# EAGLE design 2s-lvco (EAGLE 6.4)
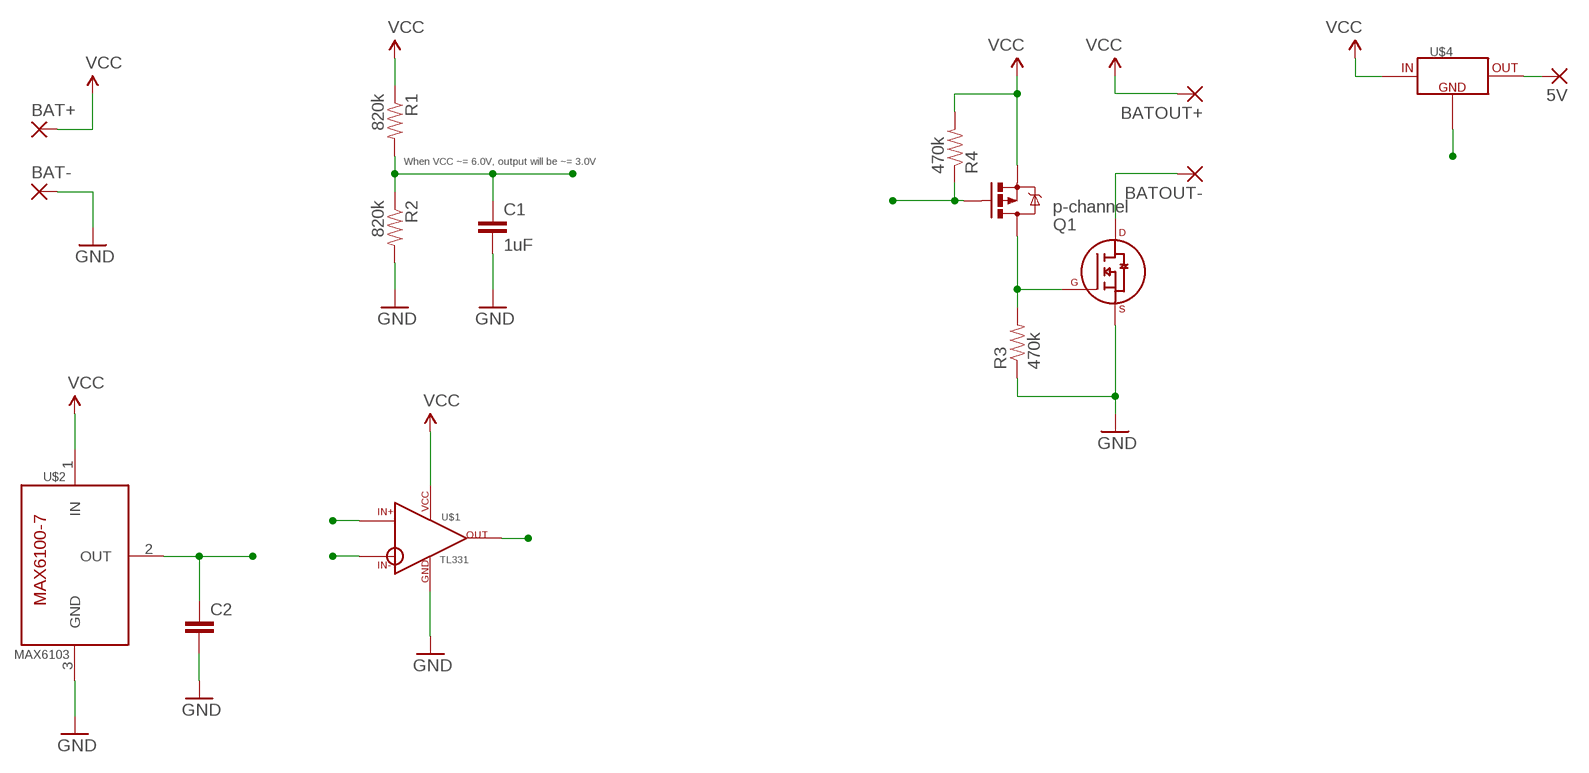
[diagram p0: schematic, sheet 1]

## Parts
5V  WIREPADSMD2,54-5,08  [SMD2,54-5,08]
BAT+  WIREPADSMD2,54-5,08  [SMD2,54-5,08]
BAT-  WIREPADSMD2,54-5,08  [SMD2,54-5,08]
BATOUT+  WIREPADSMD2,54-5,08  [SMD2,54-5,08]
BATOUT-  WIREPADSMD2,54-5,08  [SMD2,54-5,08]
C1  1uF  CAP0603-CAP  [0603-CAP]
C2  CAP0603-CAP  [0603-CAP]
Q1  p-channel  MOSFET-PCHANNELSMD  [SOT23-3]
R1  820k  RESISTOR0603-RES  [0603-RES]
R2  820k  RESISTOR0603-RES  [0603-RES]
R3  470k  RESISTOR0603-RES  [0603-RES]
R4  470k  RESISTOR0603-RES  [0603-RES]
U$1  TL331  [SOT-23-5]
U$2  MAX6103  MAX6100-MAX6107  [SOT-23-3]
U$3  RFD14N05L  [TO-252AA]
U$4  TPS715XX  [SOT-23-5]

## Nets
BATOUT-: BATOUT-.1(P) U$3.4(D) U$4.2(GND)
GND: BAT-.1(P) C1.2 C2.2 R2.2 R3.1 U$1.2(GND) U$2.3(GND) U$3.3(S)
N$1: Q1.3(D) R3.2 U$3.1(G)
N$4: 5V.1(P) U$4.5(OUT)
REF: C2.1 U$1.3(IN+) U$2.2(OUT)
SW: Q1.1(G) R4.1 U$1.4(OUT)
VCC: BAT+.1(P) BATOUT+.1(P) Q1.2(S) R1.1 R4.2 U$1.5(VCC) U$2.1(IN) U$4.4(IN)
VDIV_OUT: C1.1 R1.2 R2.1 U$1.1(IN-)

## Notes on the sheet
- When VCC ~= 6.0V, output will be ~= 3.0V

## Library data of the parts
5V BAT+ BAT- BATOUT+ BATOUT- = wirepad:WIREPAD: Wire PAD connect wire on PCB
C1 C2 = SparkFun-Capacitors:CAP: Capacitor Standard 0603 ceramic capacitor, and 0.1" leaded capacitor.
Q1 = SparkFun-DiscreteSemi:MOSFET-PCHANNEL: Generic PMOSFET
R1-R4 = SparkFun-Resistors:RESISTOR: Resistor Basic schematic elements and footprints for 0603, 1206, and PTH resistors.
U$1 = Synapseware:TL331: SINGLE DIFFERENTIAL COMPARATOR with Open-Collector output This device consists of a single voltage comparator that is designed to operate from a single power supply over a wide range of voltages. Operation from dual supplies also is possible if the difference between the two supplies is 2 V to 36 V and VCC is at least 1.5 V more positive than the input common-mode voltage. Current drain is independent of the supply voltage. The output can be connected to other open-collector outputs to achieve wired-AND relationships.
U$2 = Synapseware:MAX6100-MAX6107: The MAX6100–MAX6107 are low-cost, low-dropout (LDO), micropower voltage references. These three-terminal references are available with output voltage options of 1.25V, 1.8V, 2.048V, 2.5V, 3V, 4.096V, 4.5V, and 5V.
U$3 = Synapseware:RFD14N05L: 14A, 50V, 0.100 Ohm, Logic Level, N-Channel Power MOSFETs
U$4 = Synapseware:TPS715XX: 50 mA, 24 V, 3.2-mA Supply Current Low-Dropout Linear Regulator in SC70 (SOT-323) Package TPS71550DCKR - 5.0V version TPS71533DCKR - 3.3V version TPS71525DCKR - 2.5V version

## Board
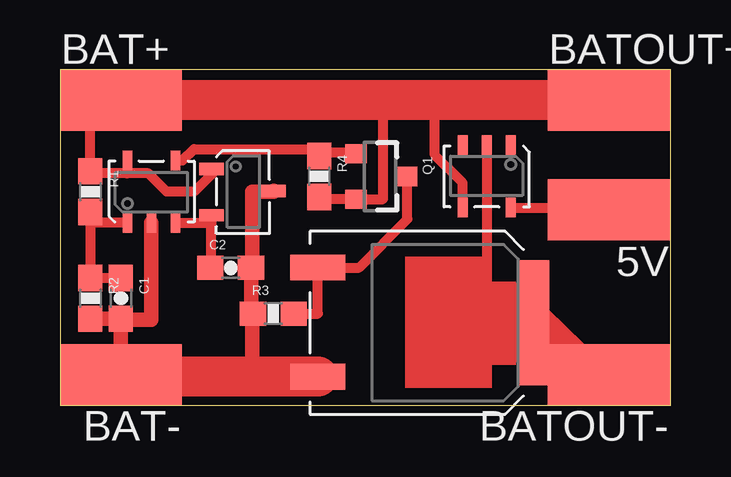
[diagram p1: board, top side]

Size 25.45 x 13.96 mm. Coordinates in mm from the lower left corner, seen from the top.
Outline: 0,0 25.45,0 25.45,13.96 0,13.96 0,0
Copper layers (1*16): Top 0.035mm / dielectric 1.5mm / Bottom 0.035mm
Design rules "default": minimum track width 10mil, minimum drill 24mil, track to track 8mil, track to pad 8mil, pad to pad 8mil, via to via 8mil, smd to smd 8mil, copper to edge 40mil, drill to drill 8mil, minimum pad ring 10mil, minimum via ring 8mil, stop-mask expansion 4mil, vias tented up to drill 0mil, thermal gap 10mil

### Footprints (pad centres in the part's own frame; a part is rotated, then mirrored left to right if it is on the bottom)
SMD2,54-5,08 = smd 2.54 x 5.08: 1 0,0
0603-CAP = smd 1.1 x 1: 1 -0.85,0; 2 0.85,0
SOT23-3 = smd 0.8 x 0.9: 1 -0.95,-1; 2 0.95,-1; 3 0,1.1
0603-RES = smd 1.1 x 1: 1 -0.85,0; 2 0.85,0
SOT-23-5 = smd 0.406 x 0.813: 1 -1,-1.3; 2 0,-1.3; 3 1,-1.3; 4 1,1.3; 5 -1,1.3
SOT-23-3 = smd 0.508 x 1.016: 1 -0.941,-1.312; 2 0.986,-1.312; 3 -0.03,1.282
TO-252AA = smd 1.067 x 2.28: 1 -2.3,-4.75; 3 2.25,-4.75 | smd 5.2 x 1.3: 4 0,4.25

### Placement (x,y rotation side)
5V  22.86,8.13 90 top
BAT+  2.54,12.7 270 top
BAT-  2.54,1.27 90 top
BATOUT+  22.86,12.7 270 top
BATOUT-  22.86,1.27 90 top
C1  2.54,4.45 270 top
C2  7.11,5.71 0 top
Q1  13.34,9.53 270 top
R1  1.27,8.89 270 top
R2  1.27,4.45 270 top
R3  8.89,3.81 0 top
R4  10.79,9.53 270 top
U$1  3.81,8.89 0 top
U$2  7.62,8.89 270 top
U$3  15.49,3.43 270 top
U$4  17.78,9.53 180 top

### Tracks (layer width: path | path; a pad name or v marks a point on that pad's centre or on a via)
BATOUT-
  Top 0.406: U$4.2 17.78,3.43 U$3.4
  Top 1.676: U$3.4 21.97,1.27 BATOUT-.1
GND
  Top 0.406: R3.1 7.96,3.6 8,3.6
  Top 0.61: 8,1.18 8,3.81 | 8,3.81 7.96,3.81 | 7.87,3.81 7.96,3.81 | 7.96,3.81 C2.2 8,5.71 8,8.89 8.9,8.89 U$2.3 | 2.54,3.56 2.58,3.6 C1.2 2.54,3.56 | 2.54,3.56 BAT-.1 | R2.2 2.5,3.6 2.54,3.56 | U$1.2 3.81,3.56 2.54,3.56 | 8,3.81 R3.1
  Top 1.676: U$3.3 8,1.18 2.54,1.18 BAT-.1
N$1
  Top 0.406: R3.2 10.74,3.81 U$3.1 12.46,5.73 14.48,7.75 14.48,9.48 Q1.3
N$4
  Top 0.406: U$4.5 22.83,8.22 22.86,8.26 5V.1
REF
  Top 0.406: C2.1 6.31,5.59 6.31,7.59 | U$1.3 6.31,7.59 | 6.31,7.59 U$2.2
SW
  Top 0.406: U$1.4 5.11,10.19 5.59,10.67 10.76,10.67 R4.1 10.79,10.5 12.31,10.5 Q1.1
VCC
  Top 0.406: BAT+.1 1.27,12.7 R1.1 1.36,9.65 2.79,9.65 | U$1.5 2.81,9.67 2.79,9.65 | 2.79,9.65 3.68,9.65 4.45,8.89 5.59,8.89 6.38,9.68 U$2.1 | Q1.2 12.34,8.53 | Q1.2 11.15,8.57 R4.2 | U$4.4 16.78,9.26 15.62,10.41 15.62,12.7 | Q1.2 13.46,8.57 13.46,12.7
  Top 1.676: BATOUT+.1 15.62,12.7 13.46,12.7 BAT+.1
VDIV_OUT
  Top 0.406: C1.1 R2.1 R1.2 1.34,7.59 U$1.1
(copper drawn outside any net)
  shapes: Top area x1